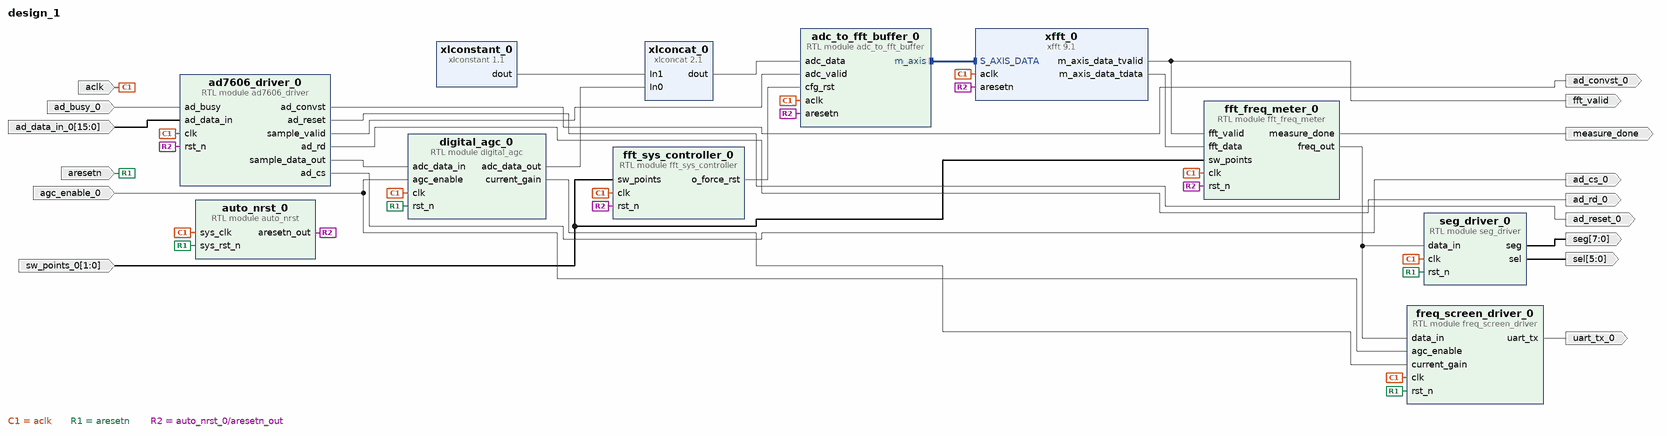
[diagram p0: block diagram of the top level]
# Vivado block design design_1, xc7a35tftg256-1, Vivado 2018.3
create_bd_design design_1

create_bd_port -dir I -type clk aclk
set_property -dict {CONFIG.ASSOCIATED_RESET aresetn CONFIG.FREQ_HZ 50000000} [get_bd_ports aclk]
create_bd_port -dir I -type rst aresetn
create_bd_port -dir O fft_valid
create_bd_port -dir O measure_done
create_bd_port -dir O ad_convst_0
create_bd_port -dir O -type rst ad_reset_0
create_bd_port -dir I ad_busy_0
create_bd_port -dir O ad_rd_0
create_bd_port -dir O ad_cs_0
create_bd_port -dir I -from 15 -to 0 ad_data_in_0
create_bd_port -dir O -from 5 -to 0 sel
create_bd_port -dir O -from 7 -to 0 seg
create_bd_port -dir I -from 1 -to 0 sw_points_0
create_bd_port -dir O uart_tx_0
create_bd_port -dir I agc_enable_0

create_bd_cell -type ip -vlnv xilinx.com:ip:xlconstant:1.1 xlconstant_0
set_property -dict {CONFIG.CONST_VAL 0 CONFIG.CONST_WIDTH 16} [get_bd_cells xlconstant_0]
create_bd_cell -type ip -vlnv xilinx.com:ip:xlconcat:2.1 xlconcat_0
create_bd_cell -type ip -vlnv xilinx.com:ip:xfft:9.1 xfft_0
set_property -dict [list \
  CONFIG.aresetn true \
  CONFIG.implementation_options radix_4_burst_io \
  CONFIG.number_of_stages_using_block_ram_for_data_and_phase_factors 0 \
  CONFIG.output_ordering natural_order \
  CONFIG.run_time_configurable_transform_length false \
  CONFIG.scaling_options block_floating_point \
  CONFIG.target_clock_frequency 50 \
  CONFIG.transform_length 4096 \
] [get_bd_cells xfft_0]
create_bd_cell -type module -reference adc_to_fft_buffer adc_to_fft_buffer_0
create_bd_cell -type module -reference ad7606_driver ad7606_driver_0
create_bd_cell -type module -reference seg_driver seg_driver_0
create_bd_cell -type module -reference fft_sys_controller fft_sys_controller_0
create_bd_cell -type module -reference auto_nrst auto_nrst_0
set_property -dict {CONFIG.CNT_MAX {"0111110101111000001111111"}} [get_bd_cells auto_nrst_0]
create_bd_cell -type module -reference fft_freq_meter fft_freq_meter_0
create_bd_cell -type module -reference digital_agc digital_agc_0
create_bd_cell -type module -reference freq_screen_driver freq_screen_driver_0

# ---- connections ----

connect_bd_intf_net [get_bd_intf_pins adc_to_fft_buffer_0/m_axis] [get_bd_intf_pins xfft_0/S_AXIS_DATA]
connect_bd_net [get_bd_pins xlconstant_0/dout] [get_bd_pins xlconcat_0/In1]
connect_bd_net [get_bd_ports aclk] \
  [get_bd_pins xfft_0/aclk] [get_bd_pins adc_to_fft_buffer_0/aclk] [get_bd_pins ad7606_driver_0/clk] \
  [get_bd_pins seg_driver_0/clk] [get_bd_pins fft_sys_controller_0/clk] [get_bd_pins auto_nrst_0/sys_clk] \
  [get_bd_pins fft_freq_meter_0/clk] [get_bd_pins digital_agc_0/clk] [get_bd_pins freq_screen_driver_0/clk]
connect_bd_net [get_bd_pins xfft_0/m_axis_data_tdata] [get_bd_pins fft_freq_meter_0/fft_data]
connect_bd_net [get_bd_pins xfft_0/m_axis_data_tvalid] [get_bd_ports fft_valid] [get_bd_pins fft_freq_meter_0/fft_valid]
connect_bd_net [get_bd_pins fft_freq_meter_0/freq_out] [get_bd_pins seg_driver_0/data_in] [get_bd_pins freq_screen_driver_0/data_in]
connect_bd_net [get_bd_pins fft_freq_meter_0/measure_done] [get_bd_ports measure_done]
connect_bd_net [get_bd_pins ad7606_driver_0/ad_convst] [get_bd_ports ad_convst_0]
connect_bd_net [get_bd_pins ad7606_driver_0/ad_reset] [get_bd_ports ad_reset_0]
connect_bd_net -net ad_busy_0_1 [get_bd_ports ad_busy_0] [get_bd_pins ad7606_driver_0/ad_busy]
connect_bd_net [get_bd_pins ad7606_driver_0/ad_rd] [get_bd_ports ad_rd_0]
connect_bd_net [get_bd_pins ad7606_driver_0/ad_cs] [get_bd_ports ad_cs_0]
connect_bd_net -net ad_data_in_0_1 [get_bd_ports ad_data_in_0] [get_bd_pins ad7606_driver_0/ad_data_in]
connect_bd_net [get_bd_pins seg_driver_0/sel] [get_bd_ports sel]
connect_bd_net [get_bd_pins seg_driver_0/seg] [get_bd_ports seg]
connect_bd_net [get_bd_pins xlconcat_0/dout] [get_bd_pins adc_to_fft_buffer_0/adc_data]
connect_bd_net [get_bd_pins ad7606_driver_0/sample_valid] [get_bd_pins adc_to_fft_buffer_0/adc_valid]
connect_bd_net -net sw_points_0_1 [get_bd_ports sw_points_0] [get_bd_pins fft_sys_controller_0/sw_points] [get_bd_pins fft_freq_meter_0/sw_points]
connect_bd_net [get_bd_pins freq_screen_driver_0/uart_tx] [get_bd_ports uart_tx_0]
connect_bd_net [get_bd_ports aresetn] \
  [get_bd_pins seg_driver_0/rst_n] [get_bd_pins auto_nrst_0/sys_rst_n] [get_bd_pins digital_agc_0/rst_n] \
  [get_bd_pins freq_screen_driver_0/rst_n]
connect_bd_net [get_bd_pins auto_nrst_0/aresetn_out] \
  [get_bd_pins fft_sys_controller_0/rst_n] [get_bd_pins xfft_0/aresetn] [get_bd_pins adc_to_fft_buffer_0/aresetn] \
  [get_bd_pins fft_freq_meter_0/rst_n] [get_bd_pins ad7606_driver_0/rst_n]
connect_bd_net [get_bd_pins fft_sys_controller_0/o_force_rst] [get_bd_pins adc_to_fft_buffer_0/cfg_rst]
connect_bd_net [get_bd_pins ad7606_driver_0/sample_data_out] [get_bd_pins digital_agc_0/adc_data_in]
connect_bd_net [get_bd_pins digital_agc_0/adc_data_out] [get_bd_pins xlconcat_0/In0]
connect_bd_net -net agc_enable_0_1 [get_bd_ports agc_enable_0] [get_bd_pins digital_agc_0/agc_enable] [get_bd_pins freq_screen_driver_0/agc_enable]
connect_bd_net [get_bd_pins digital_agc_0/current_gain] [get_bd_pins freq_screen_driver_0/current_gain]

validate_bd_design
save_bd_design
